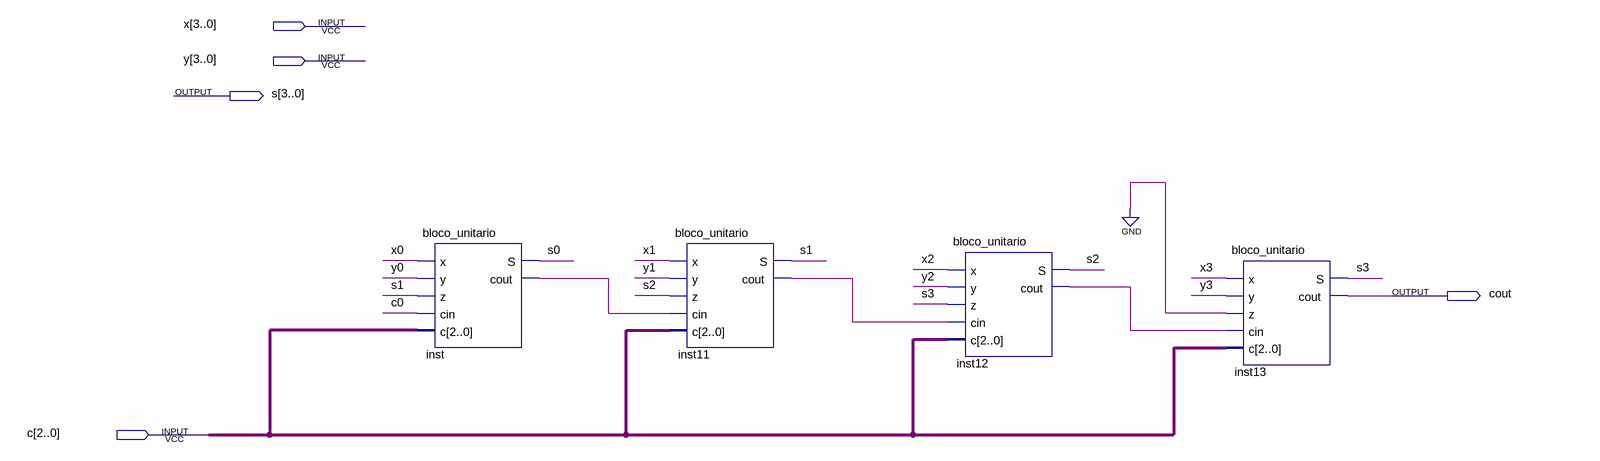
[diagram p0: schematic sheet]
// Quartus schematic mbr_prova.bdf as structural Verilog: 4 symbols, 5 pins
module mbr_prova (
  input  [3:0] x,
  input  [3:0] y,
  input  [2:0] c,
  output [3:0] s,
  output cout
);

  wire inst11_cout, inst12_cout, inst_cout;

  bloco_unitario inst (.x(x[0]), .y(y[0]), .z(s[1]), .cin(c[0]), .c(c), .S(s[0]), .cout(inst_cout));
  bloco_unitario inst11 (.x(x[1]), .y(y[1]), .z(s[2]), .cin(inst_cout), .c(c), .S(s[1]), .cout(inst11_cout));
  bloco_unitario inst12 (.x(x[2]), .y(y[2]), .z(s[3]), .cin(inst11_cout), .c(c), .S(s[2]), .cout(inst12_cout));
  bloco_unitario inst13 (.x(x[3]), .y(y[3]), .z(1'b0), .cin(inst12_cout), .c(c), .S(s[3]), .cout(cout));
endmodule
